# Altium schematic sheet Main.SchDoc
size A; SheetNumber: 1; SheetTotal: 2
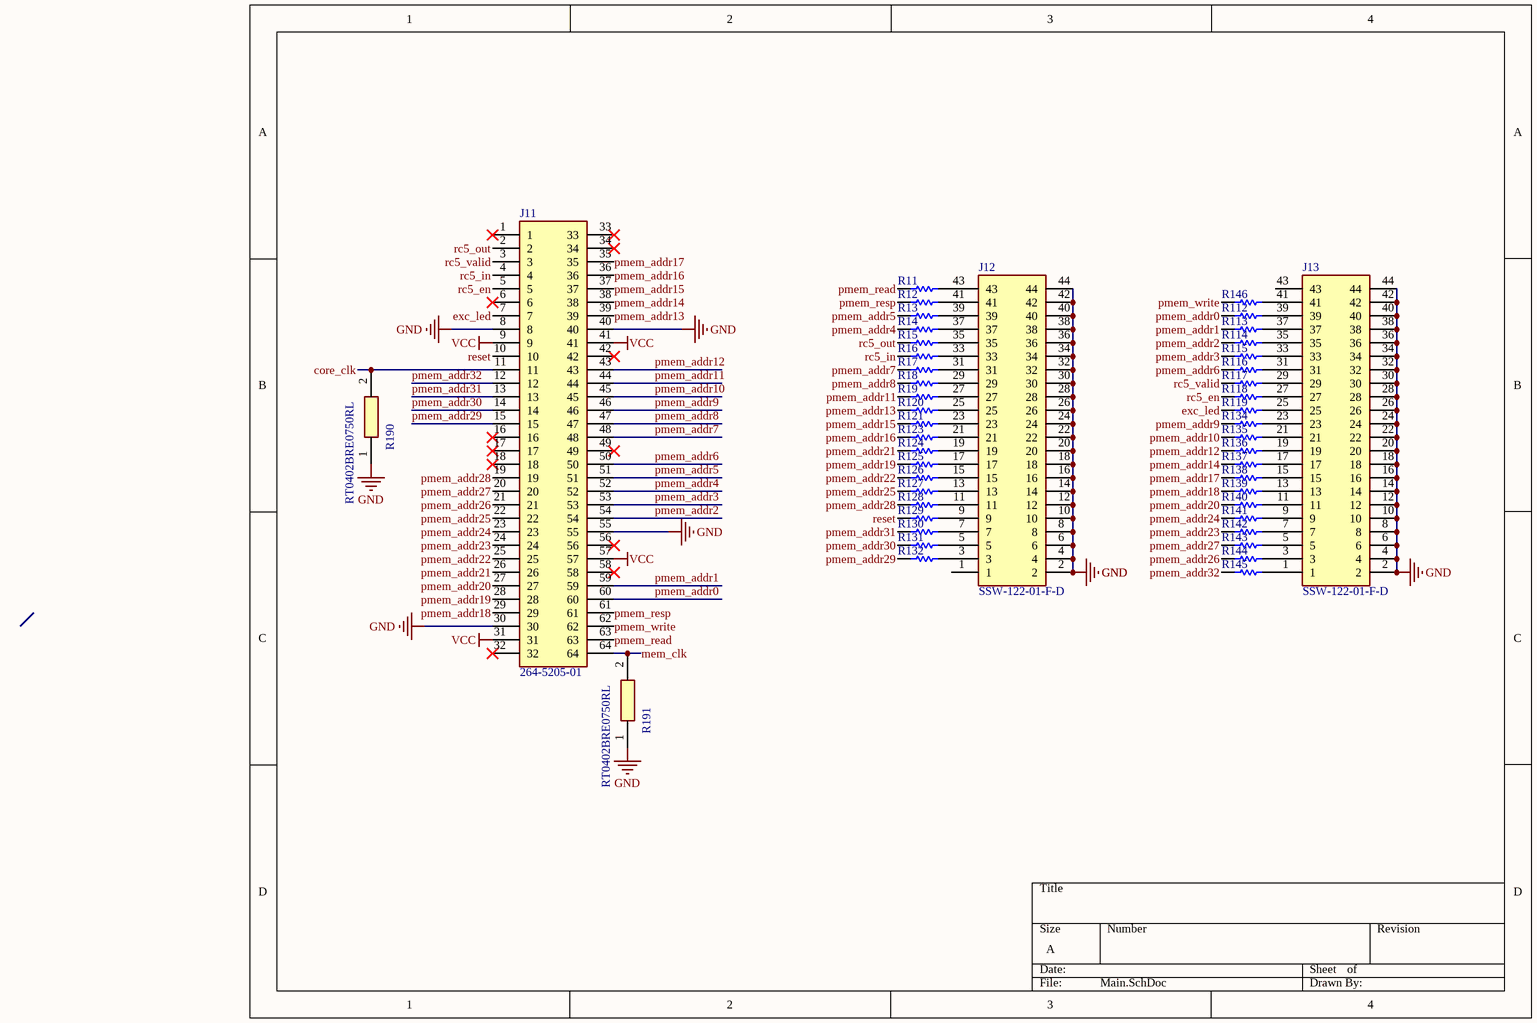
[diagram p0: Main.SchDoc]

## Parts
J11  264-5205-01  [264-5205-01_1]
J12  SSW-122-01-F-D  [SSW-122-XX-YYY-D]
J13  SSW-122-01-F-D  [SSW-122-XX-YYY-D]
R11  ERJ-U020R00X  [RESC1005X40X25NL05T10]  (value not drawn)
R12  ERJ-U020R00X  [RESC1005X40X25NL05T10]  (value not drawn)
R13  ERJ-U020R00X  [RESC1005X40X25NL05T10]  (value not drawn)
R14  ERJ-U020R00X  [RESC1005X40X25NL05T10]  (value not drawn)
R15  ERJ-U020R00X  [RESC1005X40X25NL05T10]  (value not drawn)
R16  ERJ-U020R00X  [RESC1005X40X25NL05T10]  (value not drawn)
R17  ERJ-U020R00X  [RESC1005X40X25NL05T10]  (value not drawn)
R18  ERJ-U020R00X  [RESC1005X40X25NL05T10]  (value not drawn)
R19  ERJ-U020R00X  [RESC1005X40X25NL05T10]  (value not drawn)
R112  ERJ-U020R00X  [RESC1005X40X25NL05T10]  (value not drawn)
R113  ERJ-U020R00X  [RESC1005X40X25NL05T10]  (value not drawn)
R114  ERJ-U020R00X  [RESC1005X40X25NL05T10]  (value not drawn)
R115  ERJ-U020R00X  [RESC1005X40X25NL05T10]  (value not drawn)
R116  ERJ-U020R00X  [RESC1005X40X25NL05T10]  (value not drawn)
R117  ERJ-U020R00X  [RESC1005X40X25NL05T10]  (value not drawn)
R118  ERJ-U020R00X  [RESC1005X40X25NL05T10]  (value not drawn)
R119  ERJ-U020R00X  [RESC1005X40X25NL05T10]  (value not drawn)
R120  ERJ-U020R00X  [RESC1005X40X25NL05T10]  (value not drawn)
R121  ERJ-U020R00X  [RESC1005X40X25NL05T10]  (value not drawn)
R123  ERJ-U020R00X  [RESC1005X40X25NL05T10]  (value not drawn)
R124  ERJ-U020R00X  [RESC1005X40X25NL05T10]  (value not drawn)
R125  ERJ-U020R00X  [RESC1005X40X25NL05T10]  (value not drawn)
R126  ERJ-U020R00X  [RESC1005X40X25NL05T10]  (value not drawn)
R127  ERJ-U020R00X  [RESC1005X40X25NL05T10]  (value not drawn)
R128  ERJ-U020R00X  [RESC1005X40X25NL05T10]  (value not drawn)
R129  ERJ-U020R00X  [RESC1005X40X25NL05T10]  (value not drawn)
R130  ERJ-U020R00X  [RESC1005X40X25NL05T10]  (value not drawn)
R131  ERJ-U020R00X  [RESC1005X40X25NL05T10]  (value not drawn)
R132  ERJ-U020R00X  [RESC1005X40X25NL05T10]  (value not drawn)
R134  ERJ-U020R00X  [RESC1005X40X25NL05T10]  (value not drawn)
R135  ERJ-U020R00X  [RESC1005X40X25NL05T10]  (value not drawn)
R136  ERJ-U020R00X  [RESC1005X40X25NL05T10]  (value not drawn)
R137  ERJ-U020R00X  [RESC1005X40X25NL05T10]  (value not drawn)
R138  ERJ-U020R00X  [RESC1005X40X25NL05T10]  (value not drawn)
R139  ERJ-U020R00X  [RESC1005X40X25NL05T10]  (value not drawn)
R140  ERJ-U020R00X  [RESC1005X40X25NL05T10]  (value not drawn)
R141  ERJ-U020R00X  [RESC1005X40X25NL05T10]  (value not drawn)
R142  ERJ-U020R00X  [RESC1005X40X25NL05T10]  (value not drawn)
R143  ERJ-U020R00X  [RESC1005X40X25NL05T10]  (value not drawn)
R144  ERJ-U020R00X  [RESC1005X40X25NL05T10]  (value not drawn)
R145  ERJ-U020R00X  [RESC1005X40X25NL05T10]  (value not drawn)
R146  ERJ-U020R00X  [RESC1005X40X25NL05T10]  (value not drawn)
R190  RT0402BRE0750RL  [RESC1005X35N]
R191  RT0402BRE0750RL  [RESC1005X35N]

## Nets
GND: J11.8 J11.30 J11.40 J11.55 J12.2 J12.4 J12.6 J12.8 J12.10 J12.12 J12.14 J12.16 J12.18 J12.20 J12.22 J12.24 J12.26 J12.28 J12.30 J12.32 J12.34 J12.36 J12.38 J12.40 J12.42 J12.44 J13.2 J13.4 J13.6 J13.8 J13.10 J13.12 J13.14 J13.16 J13.18 J13.20 J13.22 J13.24 J13.26 J13.28 J13.30 J13.32 J13.34 J13.36 J13.38 J13.40 J13.42 J13.44 R190.1 R191.1
VCC: J11.9 J11.31 J11.41 J11.57
core_clk: J11.11 R190.2
exc_led: J11.7 R119.1
mem_clk: J11.64 R191.2
pmem_addr0: J11.60 R112.1
pmem_addr1: J11.59 R113.1
pmem_addr2: J11.54 R114.1
pmem_addr3: J11.53 R115.1
pmem_addr4: J11.52 R14.1
pmem_addr5: J11.51 R13.1
pmem_addr6: J11.50 R116.1
pmem_addr7: J11.48 R17.1
pmem_addr8: J11.47 R18.1
pmem_addr9: J11.46 R134.1
pmem_addr10: J11.45 R135.1
pmem_addr11: J11.44 R19.1
pmem_addr12: J11.43 R136.1
pmem_addr13: J11.39 R120.1
pmem_addr14: J11.38 R137.1
pmem_addr15: J11.37 R121.1
pmem_addr16: J11.36 R123.1
pmem_addr17: J11.35 R138.1
pmem_addr18: J11.29 R139.1
pmem_addr19: J11.28 R125.1
pmem_addr20: J11.27 R140.1
pmem_addr21: J11.26 R124.1
pmem_addr22: J11.25 R126.1
pmem_addr23: J11.24 R142.1
pmem_addr24: J11.23 R141.1
pmem_addr25: J11.22 R127.1
pmem_addr26: J11.21 R144.1
pmem_addr27: J11.20 R143.1
pmem_addr28: J11.19 R128.1
pmem_addr29: J11.15 R132.1
pmem_addr30: J11.14 R131.1
pmem_addr31: J11.13 R130.1
pmem_addr32: J11.12 R145.1
pmem_read: J11.63 R11.1
pmem_resp: J11.61 R12.1
pmem_write: J11.62 R146.1
rc5_en: J11.5 R118.1
rc5_in: J11.4 R16.1
rc5_out: J11.2 R15.1
rc5_valid: J11.3 R117.1
reset: J11.10 R129.1
NetJ12_3: J12.3 R132.2
NetJ12_5: J12.5 R131.2
NetJ12_7: J12.7 R130.2
NetJ12_9: J12.9 R129.2
NetJ12_11: J12.11 R128.2
NetJ12_13: J12.13 R127.2
NetJ12_15: J12.15 R126.2
NetJ12_17: J12.17 R125.2
NetJ12_19: J12.19 R124.2
NetJ12_21: J12.21 R123.2
NetJ12_23: J12.23 R121.2
NetJ12_25: J12.25 R120.2
NetJ12_27: J12.27 R19.2
NetJ12_29: J12.29 R18.2
NetJ12_31: J12.31 R17.2
NetJ12_33: J12.33 R16.2
NetJ12_35: J12.35 R15.2
NetJ12_37: J12.37 R14.2
NetJ12_39: J12.39 R13.2
NetJ12_41: J12.41 R12.2
NetJ12_43: J12.43 R11.2
NetJ13_1: J13.1 R145.2
NetJ13_3: J13.3 R144.2
NetJ13_5: J13.5 R143.2
NetJ13_7: J13.7 R142.2
NetJ13_9: J13.9 R141.2
NetJ13_11: J13.11 R140.2
NetJ13_13: J13.13 R139.2
NetJ13_15: J13.15 R138.2
NetJ13_17: J13.17 R137.2
NetJ13_19: J13.19 R136.2
NetJ13_21: J13.21 R135.2
NetJ13_23: J13.23 R134.2
NetJ13_25: J13.25 R119.2
NetJ13_27: J13.27 R118.2
NetJ13_29: J13.29 R117.2
NetJ13_31: J13.31 R116.2
NetJ13_33: J13.33 R115.2
NetJ13_35: J13.35 R114.2
NetJ13_37: J13.37 R113.2
NetJ13_39: J13.39 R112.2
NetJ13_41: J13.41 R146.2

Not connected (* = marked no-connect by the designer): J11 1* 6* 16* 17* 18* 32* 33* 34* 42* 49* 56* 58*; J12 1; J13 43

## Library data of the parts
J11 = 264-5205-01: Connector; Manufacturer_Name: 3M; Datasheet Link: http://multimedia.3m.com/mws/media/785854O/3mtm-textooltm-open-top-sockets-for-qfn-applications-cd2475.pdf; Manufacturer_Part_Number: 264-5205-01; Mouser Part Number: 517-264-5205-01; Mouser Price/Stock: https://www.mouser.co.uk/ProductDetail/3M-Electronic-Solutions-Division/264-5205-01?qs=B2toaPEvOxGh%252BVXp%252BJO7wQ%3D%3D
J12 J13 = SSW-122-01-F-D: Connector; Manufacturer_Name: SAMTEC; Datasheet Link: http://suddendocs.samtec.com/prints/ssw-1xx-xx-xxx-x-xx-xxx-xx-mkt.pdf; Manufacturer_Part_Number: SSW-122-01-F-D; Mouser Part Number: 200-SSW12201FD; Mouser Price/Stock: https://www.mouser.co.uk/ProductDetail/Samtec/SSW-122-01-F-D?qs=92ilVni64gyO3fMj7LXwKw%3D%3D; Arrow Part Number: SSW-122-01-F-D; Arrow Price/Stock: https://www.arrow.com/en/products/ssw-122-01-f-d/samtec
R11-R19 R112-R121 R123-R132 R134-R146 = CMP-2002-06457-1: Manufacturer: Panasonic; Part Number: ERJ-U020R00X
R190 R191 = RT0402BRE0750RL: Resistor; Manufacturer_Name: YAGEO; Datasheet Link: https://www.mouser.com/datasheet/2/447/PYu_RT_1_to_0_01_RoHS_L_12-3003070.pdf; Height: 0.35mm; Manufacturer_Part_Number: RT0402BRE0750RL; Mouser Part Number: 603-RT0402BRE0750RL; Mouser Price/Stock: https://www.mouser.co.uk/ProductDetail/YAGEO/RT0402BRE0750RL?qs=NgbZBzc1CyFyREnSBGZFUg%3D%3D; Arrow Part Number: RT0402BRE0750RL; Arrow Price/Stock: https://www.arrow.com/en/products/rt0402bre0750rl/yageo?region=nac